# EAGLE design hardware-pcb (EAGLE 7.2.0)
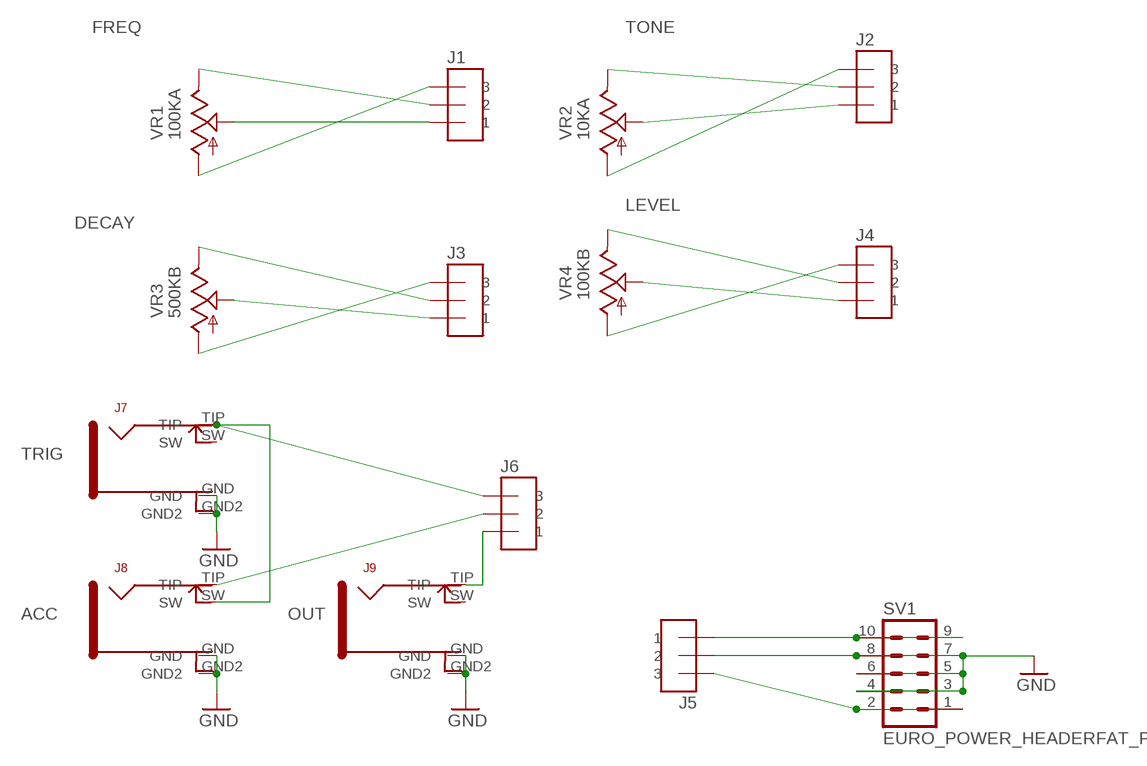
[diagram p0: schematic, sheet 1]

## Parts
J1  3X1_2_54_HEADER  [3X1_2_54_HEADER]
J2  3X1_2_54_HEADER  [3X1_2_54_HEADER]
J3  3X1_2_54_HEADER  [3X1_2_54_HEADER]
J4  3X1_2_54_HEADER  [3X1_2_54_HEADER]
J5  PWR  3X1_2_54_HEADER  [3X1_2_54_HEADER]
J6  3X1_2_54_HEADER  [3X1_2_54_HEADER]
J7  WQP_PJ_301BM  [WQP_PJ_301BM]
J8  WQP_PJ_301BM  [WQP_PJ_301BM]
J9  WQP_PJ_301BM  [WQP_PJ_301BM]
SV1  EURO_POWER_HEADERFAT_PADS  [EURO_PWR_HEADER_FAT]
VR1  100KA  ALPSPOT_VERT_9MM  [ALPS_POT_VERTICAL_PS]
VR2  10KA  ALPSPOT_VERT_9MM  [ALPS_POT_VERTICAL_PS]
VR3  500KB  ALPSPOT_VERT_9MM  [ALPS_POT_VERTICAL_PS]
VR4  100KB  ALPSPOT_VERT_9MM  [ALPS_POT_VERTICAL_PS]

## Nets
GND: J5.2 J7.GND J7.GND2 J8.GND J8.GND2 J9.GND J9.GND2 SV1.3 SV1.4 SV1.5 SV1.6 SV1.7 SV1.8
J1: J1.3 VR1.P$1(A)
N$1: J5.3 SV1.1 SV1.2
N$2: J2.2 VR2.P$2(E)
N$3: J2.1 VR2.P$3(S)
N$4: J2.3 VR2.P$1(A)
N$5: J5.1 SV1.9 SV1.10
N$7: J1.2 VR1.P$2(E)
N$8: J1.1 VR1.P$3(S)
N$9: J3.2 VR3.P$2(E)
N$10: J3.1 VR3.P$3(S)
N$11: J4.2 VR4.P$2(E)
N$12: J4.1 VR4.P$3(S)
N$13: J3.3 VR3.P$1(A)
N$14: J4.3 VR4.P$1(A)
N$15: J6.3 J7.TIP J8.SW
N$18: J6.2 J8.TIP
N$19: J6.1 J9.TIP
Unconnected: J7.SW J9.SW

## Notes on the sheet
- FREQ | TONE
- LEVEL
- DECAY
- TRIG
- ACC | OUT

## Library data of the parts
J1-J6 = mjb-pots:3X1_2_54_HEADER
J7-J9 = mjb-pots:WQP_PJ_301BM
SV1 = mjb-pots:EURO_POWER_HEADER: Power Header 10 pin power header for Eurorack Power Supplies Variants with fatter pads for easier soldering, and the LOCK variant which has 5mil offset pins to hold the component in place before soldering
VR1-VR4 = mjb-pots:ALPSPOT_VERT_9MM

## Board
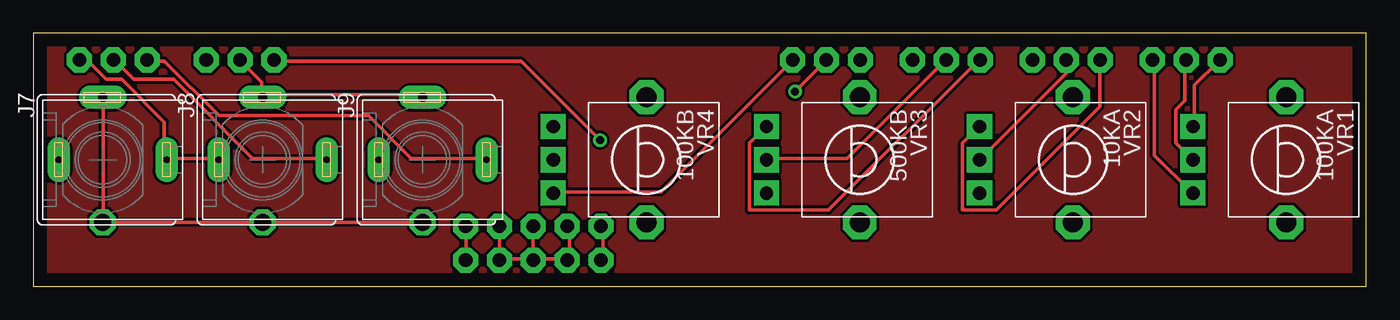
[diagram p1: board, top side]
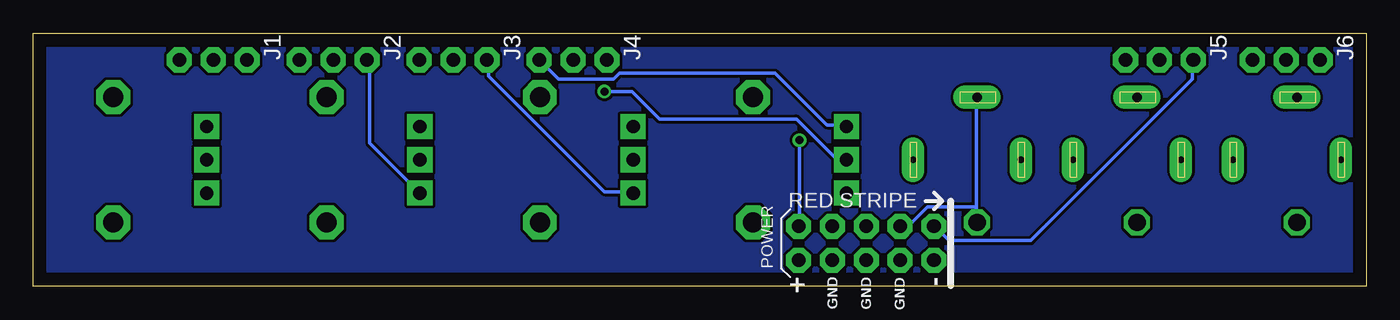
[diagram p2: board, bottom side, seen from below]

Size 100 x 19 mm. Coordinates in mm from the lower left corner, seen from the top.
Outline: 0,0 100,0 100,19 0,19 0,0
Copper layers (1*16): Top 0.035mm / dielectric 1.5mm / Bottom 0.035mm
Design rules "default": minimum track width 10mil, minimum drill 24mil, track to track 8mil, track to pad 8mil, pad to pad 8mil, via to via 8mil, smd to smd 8mil, copper to edge 40mil, drill to drill 8mil, minimum pad ring 10mil, minimum via ring 8mil, stop-mask expansion 4mil, vias tented up to drill 0mil, thermal gap 10mil

### Footprints (pad centres in the part's own frame; a part is rotated, then mirrored left to right if it is on the bottom)
3X1_2_54_HEADER = drill 1.016 pad 1.88 octagon: 1 0,2.54; 2 0,0; 3 0,-2.54
WQP_PJ_301BM = drill 0.7 pad 1.778 long: GND -4.7,0 | drill 1.3 octagon: GND2 4.7,0 | drill 0.5 pad 1.676 long: SW 0,-3.3; TIP 0,4.8
EURO_PWR_HEADER_FAT = drill 1.016 pad 1.88 octagon: 1 -5.08,-1.27; 2 -5.08,1.27; 3 -2.54,-1.27; 4 -2.54,1.27; 5 0,-1.27; 6 0,1.27; 7 2.54,-1.27; 8 2.54,1.27; 9 5.08,-1.27; 10 5.08,1.27
ALPS_POT_VERTICAL_PS = drill 1 pad 1.88 square: P$1 -2.5,7; P$2 0,7; P$3 2.5,7 | drill 1.5 pad 2.54 octagon: P$4 -4.7,0; P$5 4.7,0

### Placement (x,y rotation side)
J1  86.5,17 90 bottom
J2  77.5,17 90 bottom
J3  68.5,17 90 bottom
J4  59.5,17 90 bottom
J5  15.51,17 90 bottom
J6  6,17 90 bottom
J7  5.2,9.5 270 top
J8  17.2,9.5 270 top
J9  29.2,9.5 270 top
SV1  37.51,3.23 180 bottom
VR1  94,9.5 90 top
VR2  78,9.5 90 top
VR3  62,9.5 90 top
VR4  46,9.5 90 top

### Tracks (layer width: path | path; a pad name or v marks a point on that pad's centre or on a via)
GND
  Top 0.254: 5.26,4.8 5.26,14.17 J7.GND | SV1.7 40.23,4.34 40.23,2.06 SV1.8 40.01,2.06 37.72,2.06 SV1.6 37.49,2.06 | 34.98,2.06 34.98,4.34 SV1.3 | 37.49,2.06 37.49,4.34 SV1.5 | 37.49,2.06 34.98,2.06 | 34.98,2.06 SV1.4 | J5.2 15.54,16.92 17.14,15.32 17.14,14.4 J8.GND 17.37,14.4 29.03,14.4 J9.GND | J9.GND2 29.03,4.8 17.37,4.8 J8.GND2 17.14,4.8 5.26,4.8 | 5.26,4.8 J7.GND2
  Bottom 0.254: 29.26,5.94 29.26,4.8 J9.GND2 | 29.26,5.94 29.26,14.17 J9.GND | 29.26,5.94 32.92,5.94 34.29,4.57 34.75,4.57 SV1.3
J1
  Top 0.254: J1.3 84.12,16.92 84.12,9.83 86.87,7.09 VR1.P$1
N$1
  Top 0.254: SV1.2 32.46,2.06 32.46,4.34 SV1.1
  Bottom 0.254: J5.3 13.03,16.92 13.03,15.54 25.15,3.43 31.32,3.43 32.23,4.34 SV1.1
N$2
  Top 0.254: VR2.P$2 71.09,9.6 77.5,16 77.5,16.92 J2.2
N$3
  Top 0.254: VR2.P$3 70.87,11.89 69.72,10.74 69.72,5.71 72.24,5.71 80.01,13.49 80.01,16.92 J2.1
N$4
  Bottom 0.254: VR2.P$1 71.09,7.09 74.75,10.74 74.75,16.92 J2.3
N$5  (via drill 0.61)
  Top 0.254: SV1.10 42.75,2.06 42.75,4.34 SV1.9 | v42.52,10.97 36.58,16.92 18.06,16.92 J5.1
  Bottom 0.254: v42.52,10.97 42.52,4.57 SV1.9
N$6
  pour Top: 0,0 0,19 100,19 100,0
N$7
  Top 0.254: J1.2 86.41,16.92 86.41,13.95 85.72,13.26 85.72,10.74 86.87,9.6 VR1.P$2
N$8
  Top 0.254: VR1.P$3 87.1,12.12 87.1,15.09 88.92,16.92 J1.1
N$9
  Top 0.254: VR3.P$2 55.09,9.6 61.04,9.6 68.35,16.92 J3.2
N$10
  Top 0.254: VR3.P$3 54.86,11.89 53.72,10.74 53.72,5.71 59.66,5.71 70.87,16.92 J3.1
N$11  (via drill 0.61)
  Top 0.254: v57.15,14.63 59.44,16.92 J4.2
  Bottom 0.254: v57.15,14.63 55.09,14.63 53.03,12.57 42.75,12.57 39.78,9.6 39.09,9.6 VR4.P$2
N$12
  Bottom 0.254: VR4.P$3 39.09,12.12 40.46,12.12 44.35,16 56.01,16 56.46,15.54 60.58,15.54 61.95,16.92 J4.1
N$13
  Bottom 0.254: VR3.P$1 55.09,7.09 57.15,7.09 65.84,15.77 65.84,16.92 J3.3
N$14
  Top 0.254: VR4.P$1 39.09,7.09 47.09,7.09 56.92,16.92 J4.3
N$15
  Top 0.254: J8.SW 13.72,9.6 10.06,9.6 J7.TIP 9.83,9.6 9.83,12.34 6.63,15.54 5.49,15.54 4.12,16.92 3.66,16.92 J6.3
N$16
  pour Bottom: 0,0 0,19 100,19 100,0
N$18
  Top 0.254: J8.TIP 21.95,9.6 16.46,9.6 10.52,15.54 7.54,15.54 6.17,16.92 J6.2
N$19
  Top 0.254: J9.TIP 33.83,9.6 28.35,9.6 25.15,12.8 13.95,12.8 9.83,16.92 8.69,16.92 J6.1